# Altium schematic sheet 2_电子天平_电源.SchDoc: 电子天平_电源
size A4; Date: 2020/01/07; ApprovedBy: Riggin; CheckedBy: Riggin; Author: Riggin; DrawnBy: Riggin; Engineer: Riggin; DocumentNumber: 3; Revision: V1.0; SheetNumber: 3; SheetTotal: 8; Time: 14:09:34; ProjectName: 电子天平
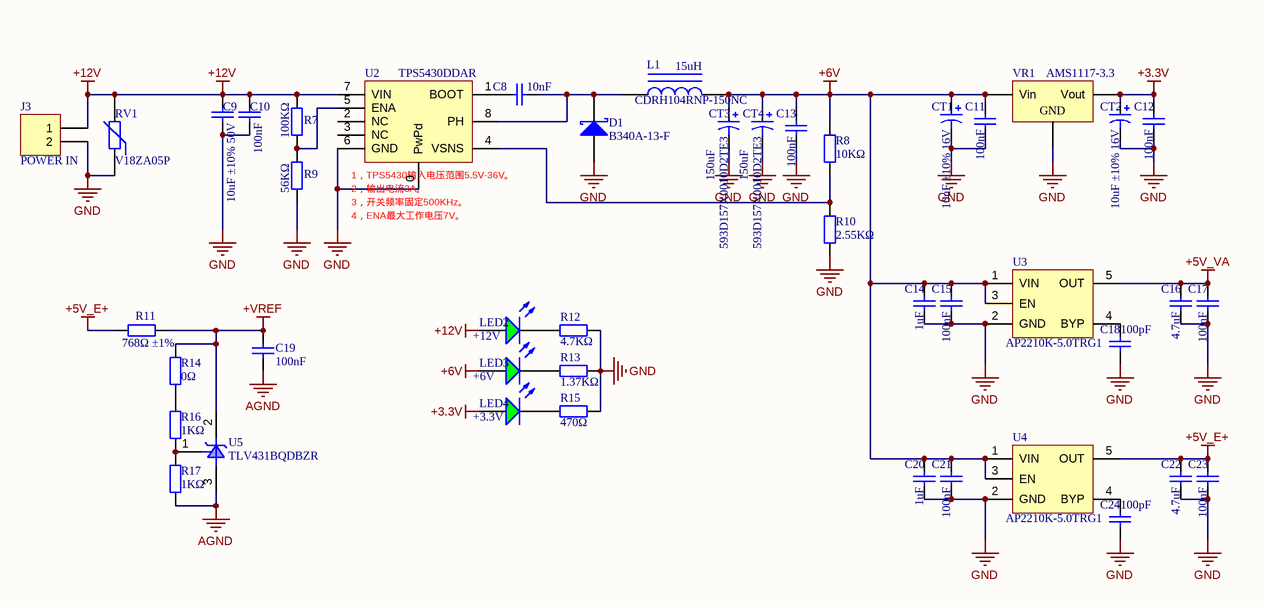
[diagram p0: 2_电子天平_电源.SchDoc]

## Parts
C8  10nF  [LC-0805_C]
C9  10uF ±10% 50V  [LC-1206_C]
C10  100nF  [LC-0805_C]
C11  100nF  [LC-0805_C]
C12  100nF  [LC-0805_C]
C13  100nF  [LC-1206_C]
C14  1uF  [LC-0805_C]
C15  100nF  [LC-0805_C]
C16  4.7uF  [LC-0805_C]
C17  100nF  [LC-0805_C]
C18  100pF  [LC-0805_C]
C19  100nF  [LC-0805_C]
C20  1uF  [LC-0805_C]
C21  100nF  [LC-0805_C]
C22  4.7uF  [LC-0805_C]
C23  100nF  [LC-0805_C]
C24  100pF  [LC-0805_C]
CT1  10uF ±10% 16V  [LC-CASE-A_3216]
CT2  10uF ±10% 16V  [LC-CASE-A_3216]
CT3  593D157X0010D2TE3  value 150uF  [LC-CASE-D_7343]
CT4  593D157X0010D2TE3  value 150uF  [LC-CASE-D_7343]
D1  B340A-13-F  [LC-SMA(DO-214AC)_S1]
J3  POWER IN  [CON-VH7.92-2P]
L1  CDRH104RNP-150NC  value 15uH  [L-CDRH104R]
LED2  +12V  [LC-0805_LED_S1]
LED3  +6V  [LC-0805_LED_S1]
LED4  +3.3V  [LC-0805_LED_S1]
R7  100KΩ  [LC-0805_R]
R8  10KΩ  [LC-0805_R]
R9  56KΩ  [LC-0805_R]
R10  2.55KΩ  [LC-0805_R]
R11  768Ω ±1%  [LC-0805_R]
R12  4.7KΩ  [LC-0805_R]
R13  1.37KΩ  [LC-0805_R]
R14  0Ω  [LC-0805_R]
R15  470Ω  [LC-0805_R]
R16  1KΩ  [LC-0805_R]
R17  1KΩ  [LC-0805_R]
RV1  V18ZA05P  [RV-V18ZA05P]
U2  TPS5430DDAR  [LC-SOP-8_EP_150mil]
U3  AP2210K-5.0TRG1  [LC-SOT-23-5]
U4  AP2210K-5.0TRG1  [LC-SOT-23-5]
U5  TLV431BQDBZR  [LC-SOT-23(SOT-23-3)]
VR1  AMS1117-3.3  [LC-SOT-223]

## Nets
+3.3V: C12.1 CT2.1 LED4.A VR1.2(Vout)
+5V_E+: C22.1 C23.1 R11.1 U4.5(OUT)
+5V_VA: C16.1 C17.1 U3.5(OUT)
+6V: C11.1 C13.1 C14.1 C15.1 C20.1 C21.1 CT1.1 CT3.1 CT4.1 L1.2 LED3.A R8.1 U3.1(VIN) U3.3(EN) U4.1(VIN) U4.3(EN) VR1.3(Vin)
+12V: C9.1 C10.1 J3.1 LED2.A R7.2 RV1.2 U2.7(VIN)
+VREF: C19.2 R11.2 R14.2 U5.2(K)
AGND: C19.1 R17.2 U5.3(A)
GND: C9.2 C10.2 C11.2 C12.2 C13.2 C14.2 C15.2 C16.2 C17.2 C18.2 C20.2 C21.2 C22.2 C23.2 C24.2 CT1.2 CT2.2 CT3.2 CT4.2 D1.1(A) J3.2 R9.1 R10.2 R12.1 R13.1 R15.1 RV1.1 U2.0(PwPd) U2.6(GND) U3.2(GND) U4.2(GND) VR1.1(GND)
NetC8_1: C8.1 U2.1(BOOT)
NetC8_2: C8.2 D1.2(K) L1.1 U2.8(PH)
NetC18_1: C18.1 U3.4(BYP)
NetC24_1: C24.1 U4.4(BYP)
NetLED2_K: LED2.K R12.2
NetLED3_K: LED3.K R13.2
NetLED4_K: LED4.K R15.2
NetR7_1: R7.1 R9.2 U2.5(ENA)
NetR8_2: R8.2 R10.1 U2.4(VSNS)
NetR14_1: R14.1 R16.2
NetR16_1: R16.1 R17.1 U5.1(R)

Not connected (* = marked no-connect by the designer): U2 2(NC) 3(NC)

## Notes on the sheet
- (near U2) 1，TPS5430输入电压范围5.5V-36V。
- (near U2) 2，输出电流3A。
- 3，开关频率固定500KHz。
- 4，ENA最大工作电压7V。
- Title
- Company:
- Address:
- 广东省广州市
- DZT Studio
- Size:
- Date:
- Drawn By:
- A4
- Riggin
- Time:
- Revision:
- Approved By:
- Sheet
- of
- Email:
- RigginLi@icloud.com
- Project:

## Library data of the parts
C8-C17 C19-C23 = Cap: MLCC; Value: 100pF; Published: 8-Jun-2000; LatestRevisionDate: 17-Jul-2002; LatestRevisionNote: Re-released for DXP Platform.; PackageReference: RAD-0.3; Publisher: Altium Limited; PackageDescription: Radial Cap, Thru-Hole; 2 Leads; 0.3 in Pin Spacing
C18 C24 = Cap: MLCC; Published: 8-Jun-2000; LatestRevisionDate: 17-Jul-2002; LatestRevisionNote: Re-released for DXP Platform.; PackageReference: RAD-0.3; Publisher: Altium Limited; PackageDescription: Radial Cap, Thru-Hole; 2 Leads; 0.3 in Pin Spacing; Value: 100pF
CT1-CT4 = Cap Pol1: 钽电容; Published: 8-Jun-2000; LatestRevisionDate: 17-Jul-2002; LatestRevisionNote: Re-released for DXP Platform.; PackageReference: RB7.6-15; Publisher: Altium Limited
  CT1 CT2: Value: 10uF
D1 = D Schottky: 肖特基二极管; Published: 8-Jun-2000; LatestRevisionDate: 17-Jul-2002; LatestRevisionNote: Re-released for DXP Platform.; PackageReference: SMB; Publisher: Altium Limited; Code_JEDEC: DO-214-AA
J3 = Header 2: Header, 2-Pin; LatestRevisionDate: 17-Jul-2002; LatestRevisionNote: Re-released for DXP Platform.; Publisher: Altium Limited
L1 = Inductor Iron: Magnetic-Core Inductor; Published: 24-Mar-1999; LatestRevisionDate: 17-Jul-2002; LatestRevisionNote: Re-released for DXP Platform.; PackageReference: AXIAL-0.9; Publisher: Altium Limited
LED2-LED4 = 0805 翠绿: 发光二极管; ComponentLink1Description: 供应商链接; ComponentLink1URL: http://www.szlcsc.com/product/details_2670.html; Package: 0805; Supplier: LC; SuppliersPartNumber: C2297
R7-R11 = Res2: Resistor; Value: 1K; Published: 8-Jun-2000; LatestRevisionDate: 17-Jul-2002; LatestRevisionNote: Re-released for DXP Platform.; PackageReference: AXIAL-0.4; Publisher: Altium Limited; PackageDescription: Axial Device, Thru-Hole; 2 Leads; 0.4 in Pin Spacing
R12 R13 R15 = 0805 47KΩ (4702) 1%: 贴片电阻; ComponentLink1Description: 供应商链接; ComponentLink1URL: http://www.szlcsc.com/product/details_18401.html; Package: 0805; Supplier: LC; SuppliersPartNumber: C17713
R14 R16 R17 = 0805 470KΩ (4703) 1%: 贴片电阻; ComponentLink1Description: 供应商链接; ComponentLink1URL: http://www.szlcsc.com/product/details_18397.html; Package: 0805; Supplier: LC; SuppliersPartNumber: C17709
RV1 = Res Varistor: Varistor (Voltage-Sensitive Resistor); Published: 24-Mar-1999; LatestRevisionDate: 29-May-2009; LatestRevisionNote: IPC-7351 Footprint Added.; PackageVersion: Mar-2003; PackageReference: 6-0805; Publisher: Altium Limited; PackageDescription: Chip Resistor 0805 Case Size; Code_IPC: RESC2012
U2 = TPS5430DDAR: 5.5V to 36V Input, 3A, Step-Down DC-DC
U3 U4 = SPX3819M5-L-5-0/TR: 5.0V固定输出，低压差700mV@Iout=500mA，Vin=16V
U5 = CJ431 0.5%431: 电压基准; ComponentLink1Description: 供应商链接; ComponentLink1URL: http://www.szlcsc.com/product/details_3500.html; Package: SOT-23; Supplier: LC; SuppliersPartNumber: C3113
VR1 = SOT-223 AMS1117-3.3: 低压差线性稳压(LDO); ComponentLink1Description: 供应商链接; ComponentLink1URL: http://www.szlcsc.com/product/details_6652.html; Package: SOT-223; Supplier: LC; SuppliersPartNumber: C6186